# EasyEDA schematic 1-Schematic_dram_sram_cell.json
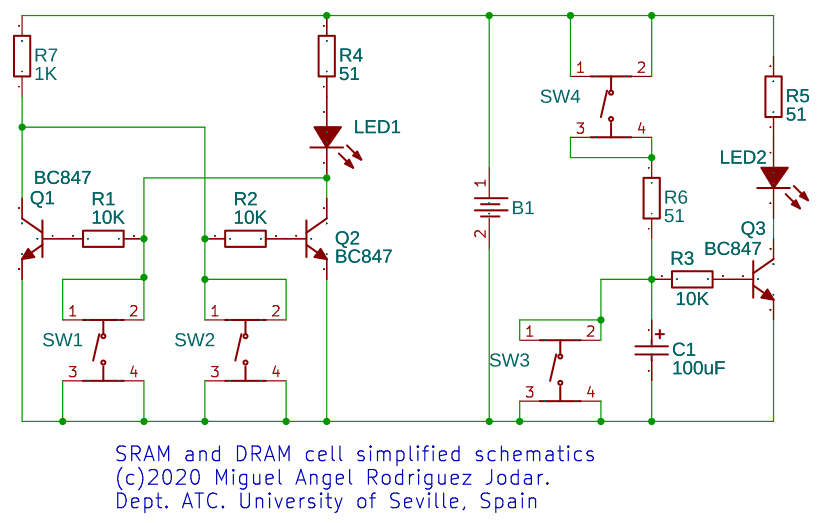
[diagram p0: schematic sheet]

## Parts
B1  CR2032-BS-6-1  [BAT-TH_CR2032-BS-6-1]
C1  100uF  [CAP-SMD_L3.5-W2.8]
LED1  KT-0603R  [LED0603-R-RD]
LED2  KT-0603R  [LED0603-R-RD]
Q1  BC847  [SOT-23-3_L2.9-W1.3-P1.90-LS2.4-BR]
Q2  BC847  [SOT-23-3_L2.9-W1.3-P1.90-LS2.4-BR]
Q3  BC847  [SOT-23-3_L2.9-W1.3-P1.90-LS2.4-BR]
R1  10K  [R0603]
R2  10K  [R0603]
R3  10K  [R0603]
R4  51  [R0603]
R5  51  [R0603]
R6  51  [R0603]
R7  1K  [R0603]
SW1  TS-1187A-C-E-B  [SW-SMD_4P-L5.1-W5.1-P3.70-LS6.4]
SW2  TS-1187A-C-E-B  [SW-SMD_4P-L5.1-W5.1-P3.70-LS6.4]
SW3  TS-1187A-C-E-B  [SW-SMD_4P-L5.1-W5.1-P3.70-LS6.4]
SW4  TS-1187A-C-E-B  [SW-SMD_4P-L5.1-W5.1-P3.70-LS6.4]

## Library data of the parts
B1 = CR2032-BS-6-1: Supplier: LCSC; Manufacturer: Q&J; image: //image.lceda.cn/szlcsc/C70377.jpg; Supplier Part: C70377; SMT Type: Extend; JLCPCB SMD: Yes
C1 = TAJB107K006RNJ: Supplier: LCSC; Manufacturer: AVX; Supplier Part: C16133; SMT Type: Basic; JLCPCB SMD: Yes
LED1 LED2 = KT-0603R: Supplier: LCSC; Manufacturer: KENTO; image: //image.lceda.cn/szlcsc/C2286.jpg; Supplier Part: C2286; SMT Type: Basic; JLCPCB SMD: Yes
Q1-Q3 = BC847: Supplier: LCSC; Manufacturer: CJ; image: //image.lceda.cn/szlcsc/C8574.jpg; Supplier Part: C8574; SMT Type: Extend; JLCPCB SMD: Yes
R1-R3 = 0603WAF1002T5E: Supplier: LCSC; Manufacturer: UniOhm; Supplier Part: C25804; SMT Type: Basic; JLCPCB SMD: Yes
R4-R6 = 0603WAF510JT5E: Supplier: LCSC; Manufacturer: UniOhm; Supplier Part: C23197; SMT Type: Basic; JLCPCB SMD: Yes
R7 = 0603WAF1001T5E: Supplier: LCSC; Manufacturer: UniOhm; Supplier Part: C21190; SMT Type: Basic; JLCPCB SMD: Yes
SW1-SW4 = TS-1187A-C-E-B: Supplier: LCSC; Supplier Part: C318887; Manufacturer: XKB Enterprise; Contributor: LCSC; SMT Type: Extend; JLCPCB SMD: Yes

## Nets
Net-(B1-1): B1.1 R4.2 R5.2 R7.2 SW4.1(A) SW4.2(B)
Net-(B1-2): B1.2 C1.2 Q1.2(E) Q2.2(E) Q3.2(E) SW1.3(C) SW1.4(D) SW2.3(C) SW2.4(D) SW3.3(C) SW3.4(D)
Net-(C1-1): C1.1 R3.1 R6.1 SW3.1(A) SW3.2(B)
Net-(LED1-1): LED1.1(A) R4.1
Net-(LED1-2): LED1.2(K) Q2.3(C) R1.2 SW1.1(A) SW1.2(B)
Net-(LED2-1): LED2.1(A) R5.1
Net-(LED2-2): LED2.2(K) Q3.3(C)
Net-(Q1-1): Q1.1(B) R1.1
Net-(Q1-3): Q1.3(C) R2.1 R7.1 SW2.1(A) SW2.2(B)
Net-(Q2-1): Q2.1(B) R2.2
Net-(Q3-1): Q3.1(B) R3.2
Net-(R6-2): R6.2 SW4.3(C) SW4.4(D)

## Notes on the sheet
- SRAM and DRAM cell simplified schematics
  (c)2020 Miguel Angel Rodriguez Jodar.
  Dept. ATC. University of Seville, Spain
